# EAGLE design T08-Schematic (EAGLE 7.7.0)
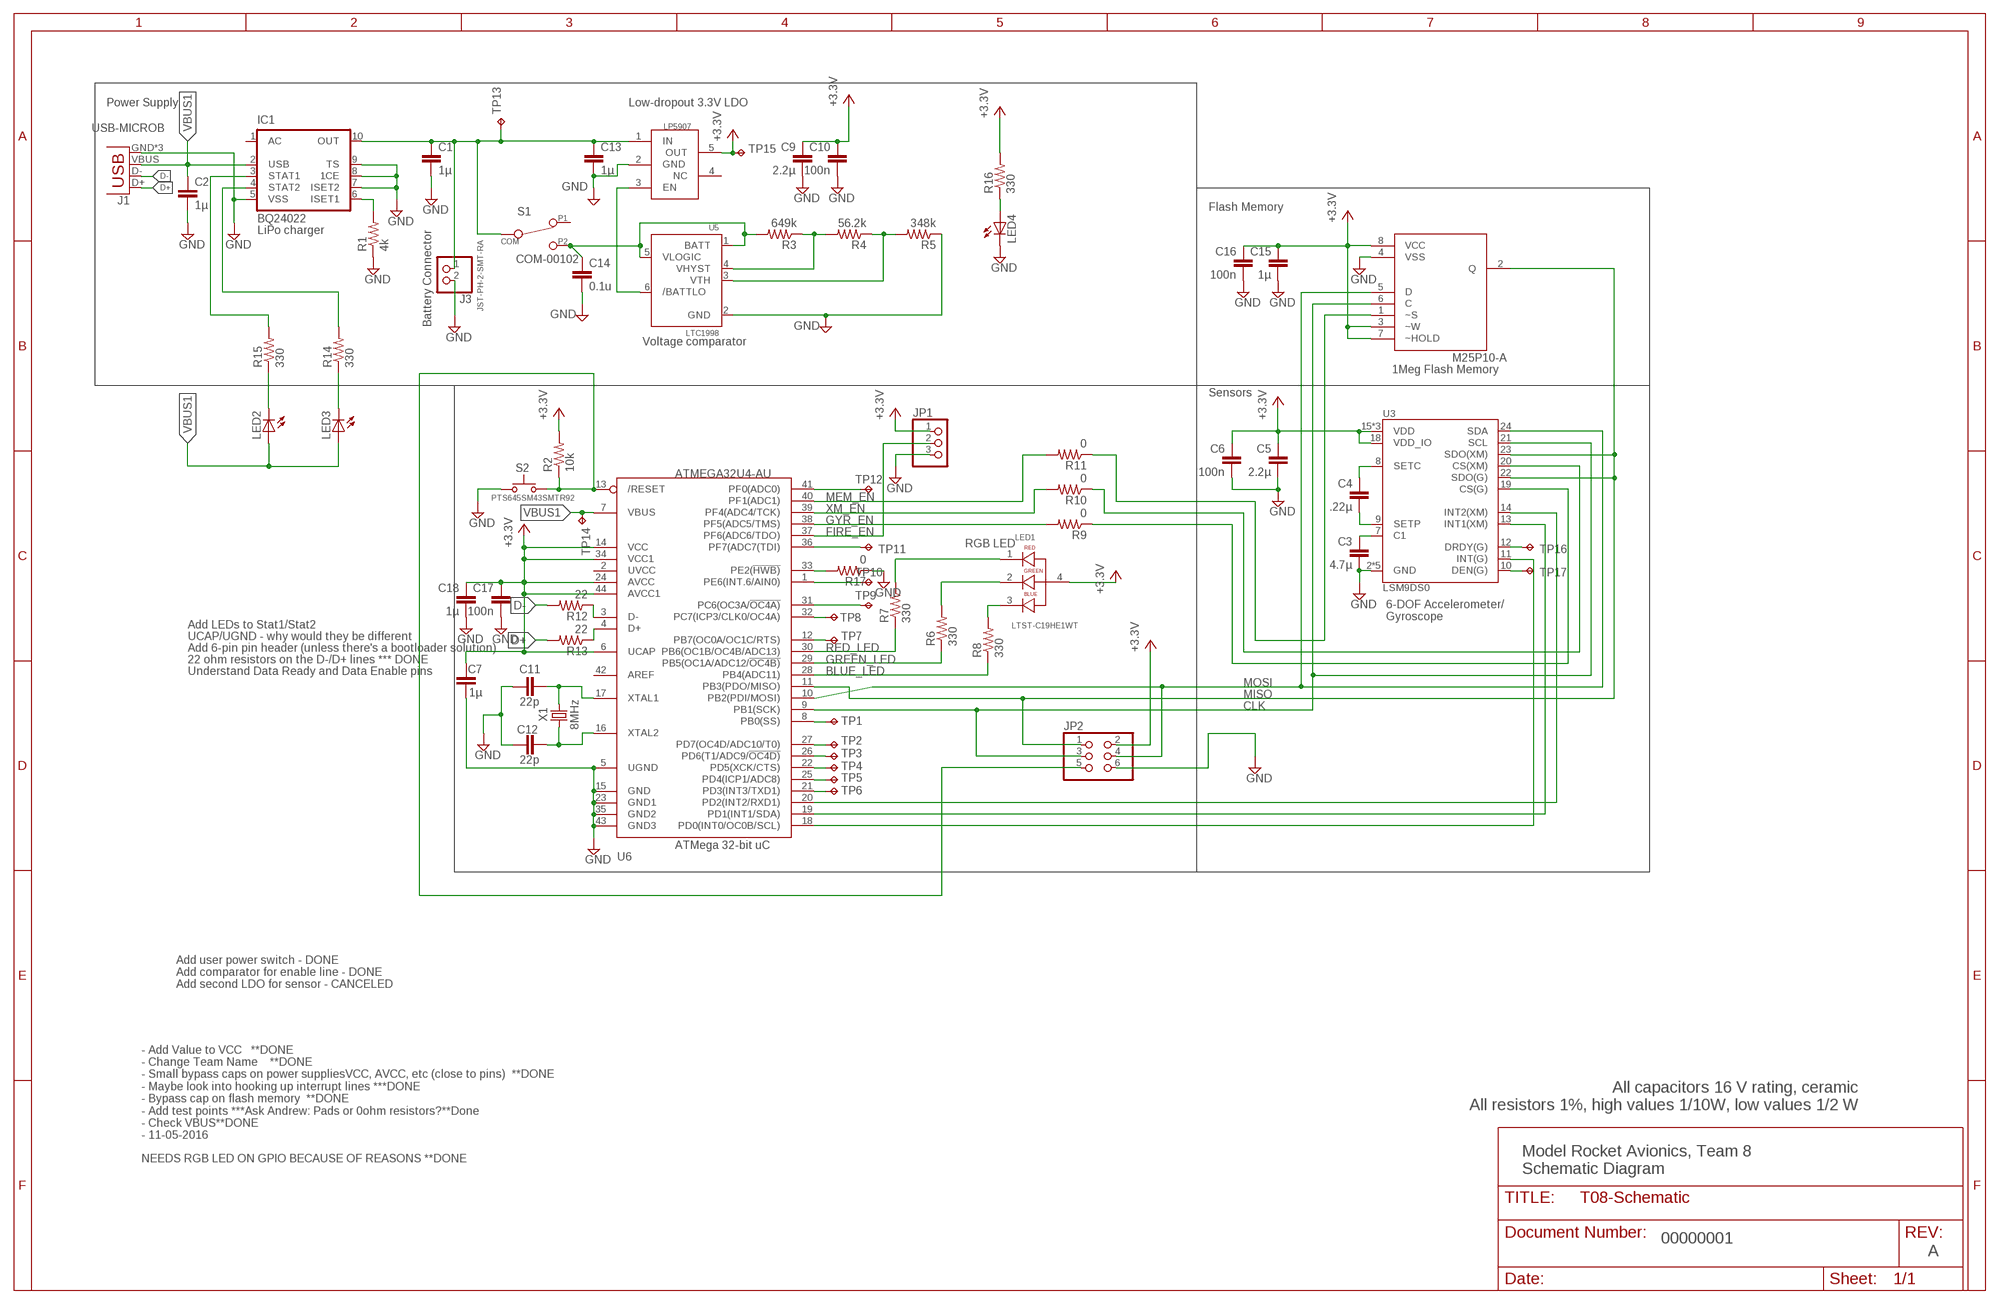
[diagram p0: schematic, sheet 1]

## Parts
C1  1µ  C-EUC0603  [C0603]
C2  1µ  C-EUC0805  [C0805]
C3  4.7µ  C-EUC0603  [C0603]
C4  .22µ  C-EUC0603  [C0603]
C5  2.2µ  C-EUC0603  [C0603]
C6  100n  C-EUC0603  [C0603]
C7  1µ  C-EUC0603  [C0603]
C9  2.2µ  C-EUC0603  [C0603]
C10  100n  C-EUC0603  [C0603]
C11  22p  C-EUC0603  [C0603]
C12  22p  C-EUC0603  [C0603]
C13  1µ  C-EUC0603  [C0603]
C14  0.1u  C-EUC0603  [C0603]
C15  1µ  C-EUC0603  [C0603]
C16  100n  C-EUC0603  [C0603]
C17  100n  C-EUC0603  [C0603]
C18  1µ  C-EUC0603  [C0603]
IC1  BQ24022  [DRC-S-PVSON-N10]
J1  USB-MICROB  [USB-MICROB]
J3  JST-PH-2-SMT-RA  JST_2PIN-SMT-RA  [JST-PH-2-SMT-RA]
JP1  PINHD-1X3  [1X03]
JP2  PINHD-2X3  [2X03]
LED1  LTST-C19HE1WT  [LEDSC85P160X160X35-4N]
LED2  LEDCHIP-LED0603  [CHIP-LED0603]
LED3  LEDCHIP-LED0603  [CHIP-LED0603]
LED4  LEDCHIP-LED0603  [CHIP-LED0603]
R1  4k  R-US_R0603  [R0603]
R2  10k  R-US_R0805  [R0805]
R3  649k  R-US_R0603  [R0603]
R4  56.2k  R-US_R0603  [R0603]
R5  348k  R-US_R0603  [R0603]
R6  330  R-US_R0805  [R0805]
R7  330  R-US_R0805  [R0805]
R8  330  R-US_R0805  [R0805]
R9  0  R-US_R0603  [R0603]
R10  0  R-US_R0603  [R0603]
R11  0  R-US_R0603  [R0603]
R12  22  R-US_R0603  [R0603]
R13  22  R-US_R0603  [R0603]
R14  330  R-US_R0805  [R0805]
R15  330  R-US_R0805  [R0805]
R16  330  R-US_R0805  [R0805]
R17  0  R-US_R0603  [R0603]
S1  COM-00102  [ESWITCH]
S2  PTS645SM43SMTR92  PTS645SSMTR  [PTS645-SMD]
TP1  TPTP08R  [TP08R]
TP2  TPTP08R  [TP08R]
TP3  TPTP08R  [TP08R]
TP4  TPTP08R  [TP08R]
TP5  TPTP08R  [TP08R]
TP6  TPTP08R  [TP08R]
TP7  TPTP08R  [TP08R]
TP8  TPTP08R  [TP08R]
TP9  TPTP08R  [TP08R]
TP10  TPTP08R  [TP08R]
TP11  TPTP08R  [TP08R]
TP12  TPTP08R  [TP08R]
TP13  TPTP08R  [TP08R]
TP14  TPTP08R  [TP08R]
TP15  TPTP08R  [TP08R]
TP16  TPTP08R  [TP08R]
TP17  TPTP08R  [TP08R]
U1  LP5907  [SOT23-5L]
U2  M25P10-AVMN6TP_TR  [SOIC127P600X175-8N]
U3  LSM9DS0  [LGA-24]
U5  LTC1998  [TSOT23-6]
U6  ATMEGA32U4-AU  [TQFP44]
X1  8MHz  CRYSTALS-NOGND-HC49/4H  [HC49]

## Nets
BLUE_LED: R8.1 U6.28(PB4(ADC11))
CLK: JP2.3 U2.6(C) U3.21(SCL) U6.9(PB1(SCK))
D+: J1.D+ R13.2
D-: J1.D- R12.2
FIRE_EN: JP1.2 U6.37(PF6(ADC6/TDO))
GND: C1.2 C2.2 C3.1 C5.2 C6.2 C7.2 C9.2 C10.2 C11.2 C12.2 C13.2 C14.2 C15.2 C16.2 C17.2 C18.2 IC1.5(VSS) IC1.7(ISET2) IC1.8(1CE) IC1.9(TS) J1.GND J1.MT1(GND) J1.MT2(GND) J3.2 JP1.3 JP2.6 LED4.C R1.1 R5.1 R17.1 S2.1(P) S2.2(P) U1.2(GND) U2.4(VSS) U3.2(GND) U3.3(GND) U3.4(GND) U3.5(GND) U3.6(GND) U5.2(GND) U6.5(UGND) U6.15(GND) U6.23(GND1) U6.35(GND2) U6.43(GND3)
GREEN_LED: R6.1 U6.29(PB5(OC1A/ADC12/!OC4B))
GYR_EN: R9.1 U3.19(CS(G))
MEM_EN: R11.1 U2.1(~S)
MISO: JP2.1 U2.2(Q) U3.22(SDO(G)) U3.23(SDO(XM)) U6.11(PB3(PDO/MISO))
MOSI: JP2.4 U2.5(D) U3.24(SDA) U6.10(PB2(PDI/MOSI))
N$1: LED1.1 R7.2
N$2: C11.1 U6.17(XTAL1) X1.1
N$3: JP2.5 R2.1 S2.3(S) S2.4(S) U6.13(/RESET)
N$4: IC1.6(ISET1) R1.2
N$5: C12.1 U6.16(XTAL2) X1.2
N$6: R12.1 U6.3(D-)
N$7: LED1.2 R6.2
N$8: LED1.3 R8.2
N$9: C3.2 U3.7(C1)
N$10: C4.2 U3.8(SETC)
N$11: C4.1 U3.9(SETP)
N$12: R3.1 R4.2 U5.4(VHYST)
N$13: C1.1 C13.1 IC1.10(OUT) J3.1 S1.2(COM) TP13.TP U1.1(IN)
N$14: R4.1 R5.2 U5.3(VTH)
N$15: C14.1 R3.2 S1.3(P2) U5.1(BATT) U5.5(VLOGIC)
N$16: U3.14(INT2(XM)) U6.20(PD2(INT2/RXD1))
N$17: U3.13(INT1(XM)) U6.19(PD1(INT1/SDA))
N$18: U1.3(EN) U5.6(/BATTLO)
N$19: U3.11(INT(G)) U6.18(PD0(INT0/OC0B/SCL))
N$20: R9.2 U6.38(PF5(ADC5/TMS))
N$21: R10.2 U6.39(PF4(ADC4/TCK))
N$22: R11.2 U6.40(PF1(ADC1))
N$47: R13.1 U6.4(D+)
N$48: LED2.C R15.1
N$49: LED3.C R14.1
N$50: IC1.3(STAT1) R15.2
N$51: IC1.4(STAT2) R14.2
N$52: TP3.TP U6.26(PD6(T1/ADC9/!OC4D))
N$53: LED4.A R16.1
N$54: TP12.TP U6.41(PF0(ADC0))
N$55: TP11.TP U6.36(PF7(ADC7(TDI))
N$56: TP10.TP U6.1(PE6(INT.6/AIN0))
N$57: TP9.TP U6.31(PC6(OC3A/!OC4A))
N$58: TP8.TP U6.32(PC7(ICP3/CLK0/OC4A))
N$59: TP7.TP U6.12(PB7(OC0A/OC1C/RTS))
N$60: TP1.TP U6.8(PB0(SS))
N$61: TP2.TP U6.27(PD7(OC4D/ADC10/T0))
N$62: TP4.TP U6.22(PD5(XCK/CTS))
N$63: TP5.TP U6.25(PD4(ICP1/ADC8))
N$64: TP6.TP U6.21(PD3(INT3/TXD1))
N$65: R17.2 U6.33(PE2(!HWB))
N$66: TP17.TP U3.10(DEN(G))
N$67: TP16.TP U3.12(DRDY(G))
RED_LED: R7.1 U6.30(PB6(OC1B/OC4B/ADC13))
VBUS1: C2.1 IC1.2(USB) J1.VBUS LED2.A LED3.A TP14.TP U6.7(VBUS)
VCC: C5.1 C6.1 C7.1 C9.1 C10.1 C15.1 C16.1 C17.1 C18.1 JP1.1 JP2.2 LED1.4 R2.2 R16.2 TP15.TP U1.5(OUT) U2.3(~W) U2.7(~HOLD) U2.8(VCC) U3.15(VDD) U3.16(VDD) U3.17(VDD) U3.18(VDD_IO) U6.6(UCAP) U6.14(VCC) U6.24(AVCC) U6.34(VCC1) U6.44(AVCC1) ; supply symbol labelled +3.3V
XM_EN: R10.1 U3.20(CS(XM))
Unconnected: IC1.1(AC) IC1.TH S1.1 U1.4(NC) U6.2(UVCC) U6.42(AREF)

## Notes on the sheet
- Power Supply | Low-dropout 3.3V LDO
- Flash Memory
- LiPo charger
- Battery Connector
- Voltage comparator
- 1Meg Flash Memory
- Sensors
- RGB LED
- 6-DOF Accelerometer/
  Gyroscope
- Add LEDs to Stat1/Stat2
- UCAP/UGND - why would they be different
- Add 6-pin pin header (unless there's a bootloader solution)
- 22 ohm resistors on the D-/D+ lines *** DONE
- Understand Data Ready and Data Enable pins
- ATMega 32-bit uC
- Add user power switch - DONE
  Add comparator for enable line - DONE
  Add second LDO for sensor - CANCELED
- All capacitors 16 V rating, ceramic
  All resistors 1%, high values 1/10W, low values 1/2 W
- - Add Value to VCC   **DONE
  - Change Team Name    **DONE
  - Small bypass caps on power suppliesVCC, AVCC, etc (close to pins)  **DONE
  - Maybe look into hooking up interrupt lines ***DONE
  - Bypass cap on flash memory  **DONE
  - Add test points ***Ask Andrew: Pads or 0ohm resistors?**Done
  - Check VBUS**DONE
  - 11-05-2016
- NEEDS RGB LED ON GPIO BECAUSE OF REASONS **DONE
- Model Rocket Avionics, Team 8
  Schematic Diagram
- 00000001
- A

## Library data of the parts
C1-C7 C9-C18 = rcl:C-EU: CAPACITOR, European symbol
IC1 = texas:BQ24022: SINGLE-CHIP, LI-ION AND LI-POL CHARGER IC WITH AUTONOMOUS USB-PORT AND AC-ADAPTER SUPPLY MANAGEMENT (bqTINY™-II) Source: bq24022.pdf (www.ti.com)
J1 = SparkFun-Connectors:USB: USB Connectors USB-B-PTH is fully proven SKU : PRT-00139/CONN-08278 USB-miniB is fully proven SKU : PRT-00587 USB-A-PCB is untested. USB-A-H is throughly reviewed, but untested. Spark Fun Electronics SKU : PRT-00437 USB-B-SMT is throughly reviewed, but untested. Needs silkscreen touching up. USB-A-S has not been used/tested USB-MB-H has not been used/tested USB-MICROB has been used. CONN-09505; PROD_ID: CONN-09505
J3 = adafruit:JST_2PIN: JST 2-Pin Connectors of various flavors SMT-RA (S2B-PH-SM4) 4UConnector #17311 SMT (B2B-PH-SM4) THM-RA (S2B-PH) THM (B2B-PH)
JP1 = pinhead:PINHD-1X3: PIN HEADER
JP2 = pinhead:PINHD-2X3: PIN HEADER
LED1 = LTST-C19HE1WT:LTST-C19HE1WT: R/G/B 0606 Flat Top Rectangle 130° 112.5/281/104 mcd Diffused Chip LED; AVAILABILITY: Good; DESCRIPTION: R/G/B 0606 Flat Top Rectangle 130° 112.5/281/104 mcd Diffused Chip LED; MF: Lite-On; MP: LTST-C19HE1WT; PACKAGE: None; PRICE: 0.59 USD; VENDOR: DIGIKEY; VENDOR_PN: 160-2162-1-ND
LED2-LED4 = adafruit:LED: LED OSRAM: - CHIPLED LG R971, LG N971, LY N971, LG Q971, LY Q971, LO R971, LY R971 LH N974, LH R974 LS Q976, LO Q976, LY Q976 LO Q996 - Hyper CHIPLED LW Q18S LB Q993, LB Q99A, LB R99A - SideLED LS A670, LO A670, LY A670, LG A670, LP A670 LB A673, LV A673, LT A673, LW A673 LH A674 LY A675 LS A676, LA A676, LO A676, LY A676, LW A676 LS A679, LY A679, LG A679 - Hyper Micro SIDELED® LS Y876, LA Y876, LO Y876, LY Y876 LT Y87S - SmartLED LW L88C, LW L88S LB L89C, LB L89S, LG L890 LS L89K, LO L89K, LY L89K LS L896, LA L896, LO L896, LY L896 - TOPLED LS T670, LO T670, LY T670, LG T670, LP T670 LSG T670, LSP T670, LSY T670, LOP T670, LYG T670 LG T671, LOG T671, LSG T671 LB T673, LV T673, LT T673, LW T673 LH T674 LS T676, LA T676, LO T676, LY T676, LB T676, LH T676, LSB T676, LW T676 LB T67C, LV T67C, LT T67C, LS T67K, LO T67K, LY T67K, LW E67C LS E67B, LA E67B, LO E67B, LY E67B, LB E67C, LV E67C, LT E67C LW T67C LS T679, LY T679, LG T679 LS T770, LO T770, LY T770, LG T770, LP T770 LB T773, LV T773, LT T773, LW T773 LH T774 LS E675, LA E675, LY E675, LS T675 LS T776, LA T776, LO T776, LY T776, LB T776 LHGB T686 LT T68C, LB T68C - Hyper Mini TOPLED® LB M676 - Mini TOPLED Santana® LG M470 LS M47K, LO M47K, LY M47K Source: http://www.osram.convergy.de/
R1-R17 = rcl:R-US_: RESISTOR, American symbol
S1 = tinyav-lib:COM-00102: Small SPDT switch listed on SparkFun as COM-00102. Equivalent to E-Switch EG1218.
S2 = switch-ck:PTS645S???SMTR: TACT SWITCH; MPN: PTS645SM43SMTR92 LFS; VENDOR: DIGIKEY; VENDOR_PN: CKN9112CT-ND
TP1-TP17 = testpad:TP: Test pad
U1 = adafruit:LP5907
U2 = SOIC127P600X175-8N:M25P10-AVMN6TP_TR
U3 = LSM9DS0:LSM9DS0; AVAILABILITY: Warning; DESCRIPTION: iNEMO inertial module: 3D accelerometer, 3D gyroscope, 3D magnetometer; MF: STMicroelectronics; MP: LSM9DS0; PACKAGE: LGA-24 STMicroelectronics; PRICE: 4.67 USD
U5 = tinyav-lib:LTC1998
U6 = adafruit:ATMEGA32U4: http://www.ladyada.net/library/eagle
X1 = IQD-Frequency-Products:CRYSTALS-NOGND: CRYSTALS CAN NOT GROUNDED; MPN: ATS080B; VENDOR: DIGIKEY; VENDOR_PN: CTX900-ND

## Board
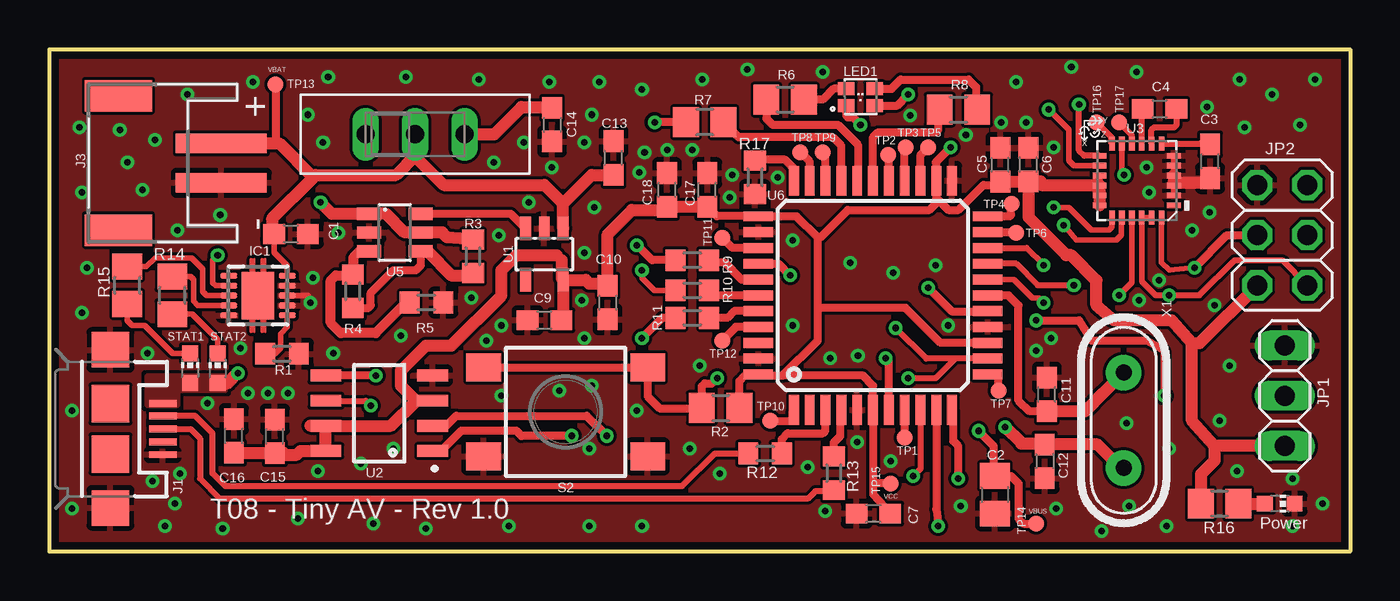
[diagram p1: board, top side]
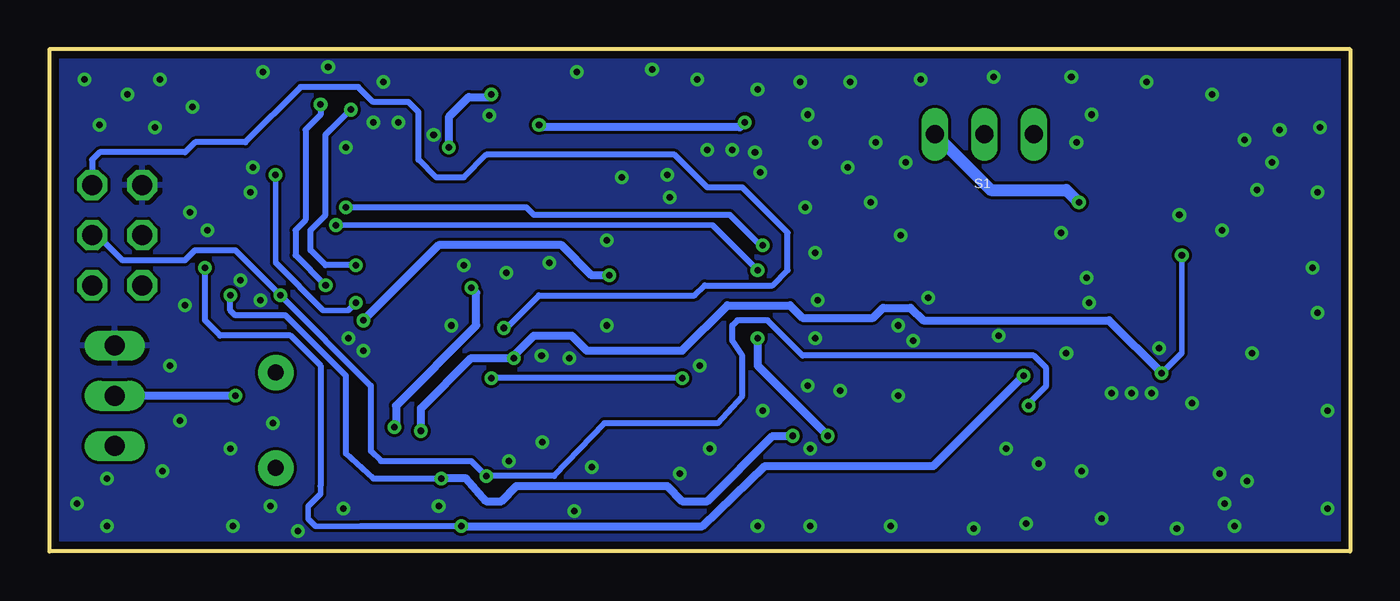
[diagram p2: board, bottom side, seen from below]

Size 65.79 x 25.4 mm. Coordinates in mm from the lower left corner, seen from the top.
Outline: 0,25.4 0,0 65.79,0 65.79,25.4 0,25.4
Copper layers (1*16): Top 0.0356mm / dielectric 1.5011mm / Bottom 0.0356mm
Design rules "LaenPCBOrder": minimum track width 6mil, minimum drill 13mil, track to track 6mil, track to pad 6mil, pad to pad 6mil, via to via 6mil, smd to smd 6mil, copper to edge 15mil, drill to drill 6mil, minimum pad ring 7mil, minimum via ring 7mil, stop-mask expansion 3mil, vias tented up to drill 0mil, thermal gap 10mil

### Footprints (pad centres in the part's own frame; a part is rotated, then mirrored left to right if it is on the bottom)
C0603 = smd 1.1 x 1: 1 -0.85,0; 2 0.85,0
C0805 = smd 1.3 x 1.5: 1 -0.95,0; 2 0.95,0
DRC-S-PVSON-N10 = smd 0.28 x 0.85: 1 -1,-1.475; 2 -0.5,-1.475; 3 0,-1.475; 4 0.5,-1.475; 5 1,-1.475; 6 1,1.475; 7 0.5,1.475; 8 0,1.475; 9 -0.5,1.475; 10 -1,1.475 | smd 2.4 x 1.65: TH 0,0
USB-MICROB = smd 0.35 x 1.4: D+ 0,2.65; D- -0.65,2.65; GND 1.3,2.65; ID 0.65,2.65; VBUS -1.3,2.65 | smd 1.8 x 1.9: MT1 -4,0; MT2 4,0 | smd 1.9 x 1.9: P$1 -1.27,0; P$2 1.27,0
JST-PH-2-SMT-RA = smd 1 x 4.6: 1 1,-3.7; 2 -1,-3.7 | smd 1.6 x 3.4: NC1 -3.4,1.5; NC2 3.4,1.5
1X03 = drill 1.016 long: 1 -2.54,0; 2 0,0; 3 2.54,0
2X03 = drill 1.016 octagon: 1 -2.54,-1.27; 2 -2.54,1.27; 3 0,-1.27; 4 0,1.27; 5 2.54,-1.27; 6 2.54,1.27
LEDSC85P160X160X35-4N = smd 0.65 x 0.85: 1 -0.425,0.725; 2 0.425,0.725; 3 0.425,-0.725; 4 -0.425,-0.725
CHIP-LED0603 = smd 0.8 x 0.8: A 0,-0.75; C 0,0.75
R0603 = smd 1 x 1.1: 1 -0.85,0; 2 0.85,0
R0805 = smd 1.3 x 1.5: 1 -0.95,0; 2 0.95,0
ESWITCH = drill 0.9 pad 1.2 long: 1 -2.5,0; 2 0,0; 3 2.5,0
PTS645-SMD = smd 1.75 x 1.4: 1 -4.15,2.25; 2 4.15,2.25; 3 -4.15,-2.25; 4 4.15,-2.25
TP08R = smd 0.8 x 0.8: TP 0,0
SOT23-5L = smd 0.55 x 1.2: 1 -0.95,-1.3; 2 0,-1.3; 3 0.95,-1.3; 4 0.95,1.3; 5 -0.95,1.3
SOIC127P600X175-8N = smd 1.55 x 0.6: 1 -2.7,1.905; 2 -2.7,0.635; 3 -2.7,-0.635; 4 -2.7,-1.905; 5 2.7,-1.905; 6 2.7,-0.635; 7 2.7,0.635; 8 2.7,1.905
LGA-24 = smd 0.7 x 0.29: 1 -1.875,1.25; 2 -1.875,0.75; 3 -1.875,0.25; 4 -1.875,-0.25; 5 -1.875,-0.75; 6 -1.875,-1.25; 13 1.875,-1.25; 14 1.875,-0.75; 15 1.875,-0.25; 16 1.875,0.25; 17 1.875,0.75; 18 1.875,1.25 | smd 0.29 x 0.7: 7 -1.25,-1.875; 8 -0.75,-1.875; 9 -0.25,-1.875; 10 0.25,-1.875; 11 0.75,-1.875; 12 1.25,-1.875; 19 1.25,1.875; 20 0.75,1.875; 21 0.25,1.875; 22 -0.25,1.875; 23 -0.75,1.875; 24 -1.25,1.875
TSOT23-6 = smd 0.62 x 1.22: 1 -0.95,-1.3; 2 0,-1.3; 3 0.95,-1.3; 4 0.95,1.3; 5 0,1.3; 6 -0.95,1.3
TQFP44 = smd 1.5 x 0.5: 1 -5.8,4; 2 -5.8,3.2; 3 -5.8,2.4; 4 -5.8,1.6; 5 -5.8,0.8; 6 -5.8,0; 7 -5.8,-0.8; 8 -5.8,-1.6; 9 -5.8,-2.4; 10 -5.8,-3.2; 11 -5.8,-4; 23 5.8,-4; 24 5.8,-3.2; 25 5.8,-2.4; 26 5.8,-1.6; 27 5.8,-0.8; 28 5.8,0; 29 5.8,0.8; 30 5.8,1.6; 31 5.8,2.4; 32 5.8,3.2; 33 5.8,4 | smd 0.5 x 1.5: 12 -4,-5.8; 13 -3.2,-5.8; 14 -2.4,-5.8; 15 -1.6,-5.8; 16 -0.8,-5.8; 17 0,-5.8; 18 0.8,-5.8; 19 1.6,-5.8; 20 2.4,-5.8; 21 3.2,-5.8; 22 4,-5.8; 34 4,5.8; 35 3.2,5.8; 36 2.4,5.8; 37 1.6,5.8; 38 0.8,5.8; 39 0,5.8; 40 -0.8,5.8; 41 -1.6,5.8; 42 -2.4,5.8; 43 -3.2,5.8; 44 -4,5.8
HC49 = drill 0.813 pad 1.8: 1 -2.413,0; 2 2.413,0

### Placement (x,y rotation side)
C1  12.22,16.06 0 top
C2  47.82,2.87 270 top
C3  58.71,19.74 90 top
C4  56.15,22.39 0 top
C5  48.09,19.56 90 top
C6  49.52,19.57 90 top
C7  41.68,1.92 180 top
C9  25.04,11.7 180 top
C10  28.23,12.59 270 top
C11  50.45,7.94 90 top
C12  50.34,4.56 270 top
C13  28.53,19.9 90 top
C14  25.42,21.59 270 top
C15  11.4,5.82 90 top
C16  9.33,5.84 90 top
C17  33.27,18.29 90 top
C18  31.24,18.29 90 top
IC1  10.55,12.94 270 top
J1  3.09,6.2 270 top
J3  4.99,19.65 90 top
JP1  62.48,7.87 90 top
JP2  62.36,16 90 top
LED1  41.02,22.99 90 top
LED2  7.11,9.27 0 top
LED3  8.51,9.27 0 top
LED4  62.23,2.41 270 top
R1  11.77,10 180 top
R2  33.95,7.26 0 top
R3  21.42,14.93 90 top
R4  15.35,13.16 270 top
R5  19.07,12.59 180 top
R6  37.21,22.86 0 top
R7  33.15,21.72 180 top
R8  45.97,22.35 0 top
R9  32.51,14.73 0 top
R10  32.51,13.21 0 top
R11  32.51,11.81 0 top
R12  36.2,4.95 180 top
R13  39.68,3.95 270 top
R14  6.22,12.95 90 top
R15  3.94,13.46 90 top
R16  59.18,2.41 180 top
R17  35.69,18.92 90 top
S1  18.49,21.11 0 top
S2  26.11,7.06 180 top
TP1  43.26,5.75 0 top
TP2  42.42,20.07 0 top
TP3  43.31,20.45 0 top
TP4  48.66,17.59 0 top
TP5  44.45,20.45 0 top
TP6  48.9,16.13 0 top
TP7  48.01,8.13 0 top
TP8  37.97,20.19 0 top
TP9  39.12,20.19 0 top
TP10  36.45,6.6 0 top
TP11  34.04,15.88 0 top
TP12  34.04,10.67 0 top
TP13  11.43,23.62 0 top
TP14  49.91,1.4 0 top
TP15  42.55,3.43 0 top
TP16  52.96,21.72 0 top
TP17  54.1,21.72 0 top
U1  25.03,15.04 180 top
U2  16.68,6.99 180 top
U3  55,18.76 180 top
U5  17.47,16.14 270 top
U6  41.66,12.95 90 top
X1  54.34,6.63 270 top

### Tracks (layer width: path | path; a pad name or v marks a point on that pad's centre or on a via)
BLUE_LED
  Top 0.406: 44.78,22.34 R8.1 | 45.09,22.29 R8.1 | U6.28 41.66,20.95 41.91,21.21 44.83,21.21 44.96,21.34 44.96,22.29 R8.1
CLK  (via drill 0.33)
  Top 0.279: U3.21 54.75,13.6 v54.1,12.95
  Top 0.305: U6.9 44.06,4.18 v43.69,3.81 | U2.6 16,7.62 v16.26,7.37
  Bottom 0.305: v16.26,7.37 16.26,7.49 15.37,8.38 15.37,9.27 16,9.91 27.69,9.91 29.46,11.68 30.99,11.68 31.24,11.43 31.24,10.67 30.73,9.91 30.73,7.87 32,6.48 37.72,6.48 40.26,3.81 v43.69,3.81 44.45,4.57 49.02,4.57 49.53,5.08 49.53,8.38 v54.1,12.95 56.39,15.24 58.42,15.24 58.93,14.73 62.1,14.73 63.37,16 JP2.3
D+
  Top 0.305: J1.D+ 7.14,6.2 7.62,5.71 7.62,3.68 8.64,2.67 38.35,2.67 38.73,3.05 39.62,3.05
  Top 0.406: 39.62,3.05 R13.2
D-
  Top 0.305: J1.D- 7.37,6.86 8.26,5.97 8.26,3.94 8.89,3.3 32,3.3 33.66,4.95 R12.2
FIRE_EN  (via drill 0.33)
  Top 0.406: U6.37 36.88,14.55 v37.47,13.97 | v49.91,11.68 52.07,11.68 52.7,10.67 55.5,10.67 56.39,10.16 v56.39,7.87
  Bottom 0.406: v37.47,13.97 38.35,13.97 39.88,15.49 46.1,15.49 v49.91,11.68 | v56.39,7.87 JP1.2
GND  (via drill 0.33)
  Top 0.279: IC1.8 13.09,12.94 v13.21,12.57
  Top 0.305: U3.6 U3.5 U3.4 U3.3 U3.2
  Top 0.61: U3.4 56.87,18.69 56.9,18.67 58.59,18.67 C3.1
  other vias: 13.08,22.1 3.94,19.68 24,20.7 27.05,20.7 29.84,19.18 37.59,15.75 42.55,4.57 49.4,21.72 48.13,21.72 8.64,17.02 10.03,8 22.86,11.43 40.85,5.52 25.78,8.13 29.72,7.11 32.89,9.4 17.78,10.92 11.05,8 12.06,8 27.3,5.21 27.56,17.4 6.99,23.11 18.03,24 25.27,23.75 14.1,24 1.52,21.46 27.3,1.27 19.05,1.14 31.24,20.32 34.54,19.05 48.9,23.75 54.99,24.26 40.51,14.61 27.05,15.11 14.61,16.13 50.8,20.45 32.51,20.32 30.1,20.19 39.24,2.03 46.1,2.29 26.92,12.7 27.05,10.79 22.1,10.67 27.43,22.1 25.4,19.43 24.26,17.65 50.93,2.16 53.21,1.02 49.91,10.16 50.67,10.79 55.63,18.16 55.5,19.43 29.97,1.27 54.48,6.48 54.61,2.29 23.24,1.27 1.65,18.16 37.59,11.43 21.72,23.88 17.4,5.21 15.75,4.45 22.73,16 4.7,18.29 27.81,23.75 22.86,7.87 32.38,5.21 14.35,10.03 13.84,20.7 22.48,19.68 38.34,4.26 43.53,22.05 33.91,3.94 40.89,9.91 9.65,10.29 13.34,13.84 21.34,12.83 8,7.49 1.65,12.06 1.91,14.35 1.14,7.11 6.35,2.41 1.14,2.16 8.76,1.14 12.57,1.65 16.38,1.4 13.59,4.06 5.21,3.56 6.6,3.94 4.95,10.03 5.84,1.27 6.48,16.26 58.93,12.45 56.13,13.72 55.12,12.7 44.83,14.48 42.67,14.1 59.69,9.4 59.18,6.6 57.78,16.26 58.67,17.14 36.83,18.92 3.56,21.34 33.02,23.88 39.12,24.26 35.31,24.38 29.97,23.37 10.29,23.75 60.07,4.06 64.39,2.41 62.87,3.68 62.87,1.27 56.64,5.21 56.52,1.27 58.55,22.48 60.2,23.88 60.45,21.46 61.85,23.11 64.01,23.88 63.25,21.59 46.35,21.08 34.42,17.91 45.47,11.43 39.5,9.78 51.69,24.51 27.43,8.38 5.33,20.83
  pour Bottom (rank 2): 0,25.4 65.79,25.4 65.79,0 0,0
  pour Top (rank 2): 0,25.4 65.79,25.4 65.79,0 0,0
GREEN_LED
  Top 0.406: R6.1 36.26,21.91 36.58,21.59 39.88,21.59 40.89,20.57 40.89,18.79 U6.29
GYR_EN  (via drill 0.33)
  Top 0.279: U3.19 53.75,16.41 53.59,16.26 52.7,16.26 51.56,17.4 v50.8,17.4
  Top 0.406: R9.1 30.48,14.73 v29.72,15.49
  Bottom 0.305: v29.72,15.49 29.84,15.49 31.37,17.02 41.27,17.02 41.66,17.4 v50.8,17.4
MEM_EN  (via drill 0.33)
  Top 0.406: v26.42,5.84 23.88,5.84 23.62,6.1 20.83,6.1 19.81,5.08 U2.1 | R11.1 30.99,11.81 v29.97,10.79
  Bottom 0.406: v29.97,10.79 29.97,9.4 v26.42,5.84
MISO  (via drill 0.33)
  Top 0.279: U3.22 55.25,13.65 55.94,12.96
  Top 0.305: U3.22 U3.23 | 55.94,12.96 56.63,12.96 | 56.63,12.96 v56.64,12.95 | 56.63,12.96 58.17,12.96 59.94,14.73 62.36,14.73 JP2.1
  Top 0.406: U2.2 20.07,6.35 20.57,6.86 27.18,6.86 v28.19,5.84 | v45.97,3.68 45.97,5.33 45.72,5.59 45.72,7.09 U6.11
  Bottom 0.305: v45.97,3.68 49.4,3.68 50.8,4.95 50.8,8.89 53.85,11.94 56.39,11.94 56.64,12.19 v56.64,12.95
  Bottom 0.406: v45.97,3.68 44.7,3.68 43.69,2.54 42.93,2.54 42.16,3.3 34.54,3.3 33.78,2.54 32.51,2.54 29.21,5.84 v28.19,5.84
MOSI  (via drill 0.33)
  Top 0.279: U3.24 56.25,14.62 56.64,14.22 v57.91,14.35
  Top 0.305: 57.91,14.22 v57.91,14.35
  Top 0.406: U6.10 44.86,2.13 v44.96,1.27 | v16.51,8.89 U2.5 | 57.91,14.22 v57.91,14.35 59.56,16 JP2.4
  Bottom 0.279: 52.07,3.3 52.07,2.92 52.7,2.29 52.7,1.65 52.32,1.27 50.04,1.27
  Bottom 0.305: 52.07,3.3 52.07,9.4 53.59,10.92 57.15,10.92 57.91,11.68 v57.91,14.35 | v44.96,1.27 50.04,1.27
  Bottom 0.406: v44.96,1.27 32.77,1.27 29.59,4.32 21.08,4.32 v16.51,8.89
N$1  (via drill 0.33)
  Top 0.406: R7.2 v30.61,21.72 | LED1.1 40.3,22.06 40.39,21.97 40.64,21.97 v41.02,21.59
  Bottom 0.406: v30.61,21.72 30.86,21.46 40.89,21.46 v41.02,21.59
N$2
  Top 0.406: U6.17 48.51,12.95 49.02,12.45 49.02,7.62 49.53,7.11 50.43,7.11 C11.1
  Top 0.61: X1.1 53.3,8.01 53.29,8.01 52.37,7.09 C11.1
N$3  (via drill 0.33)
  Top 0.305: 33.89,8.66 v33.78,8.76 | v43.43,8.76 44.83,8.76 45.85,9.78 47.43,9.78 U6.13 44.35,9.75 v42.8,11.3
  Top 0.406: S2.4 S2.3 30.26,7.84 30.86,7.24 32.98,7.24 R2.1 33,8.36 33.15,8.51 33.53,8.51 v33.78,8.76
  Bottom 0.305: v33.78,8.76 v43.43,8.76 | v42.8,11.3 42.67,11.3 41.02,12.95 33.15,12.95 32.64,13.46 29.21,13.46 28.45,14.22 28.45,16.13 30.73,18.41 32.51,18.41 34.16,20.07 43.69,20.07 44.83,18.92 46.23,18.92 47.12,19.81 47.12,22.23 47.62,22.73 49.4,22.73 50.16,23.5 53.09,23.5 55.88,20.7 58.42,20.7 58.93,20.19 63.25,20.19 63.63,19.81 JP2.5
N$4
  Top 0.279: R1.2 11.4,10 11.68,10.29 11.68,11.01 12.03,11.35 IC1.6
N$5  (via drill 0.33)
  Top 0.406: U6.16 45.64,12.15 v44.45,13.34
  Top 0.61: X1.2 54.19,4.22 53.01,5.41 C12.1 50.28,5.46 49.15,5.46 49.15,5.48 v48.34,6.29
  Bottom 0.406: v44.45,13.34 44.2,13.08 44.2,11.43 48.26,7.37 48.26,6.37 v48.34,6.29
N$6
  Top 0.406: R12.1 37.05,5.68 37.34,5.97 39.12,5.97 39.24,6.1 39.24,7.14 U6.3
N$7
  Top 0.406: LED1.2 39.67,23.41 39.12,22.86 R6.2
N$8
  Top 0.406: LED1.3 42.59,23.41 43.05,23.88 46.48,23.88 46.86,23.5 46.86,22.41 R8.2
N$9
  Top 0.305: U3.7 58.19,20.64 C3.2
N$10
  Top 0.305: U3.8 55.75,21.33 55.88,21.46 56.9,21.46 57.02,21.59 57.02,22.36 C4.2
N$11
  Top 0.305: U3.9 55.25,22.33 C4.1
N$12
  Top 0.406: U5.4 18.79,15.16 18.8,15.16 18.8,14.48 18.54,14.22 17.4,14.22 16.26,13.08 16.26,12.45 16.12,12.31 R4.2
  Top 0.61: 18.79,15.16 19.13,15.16 20.32,13.97 21.41,13.97 R3.1
N$13
  Top 0.279: IC1.10 12.03,14.47 11.37,15.13 C1.1
  Top 0.406: 11.01,15.8 C1.1 | TP13.TP 11.43,20.83 11.61,20.65
  Top 0.61: C1.1 11.27,16.86 13.34,18.92 | 13.34,18.92 13.46,19.05 17.53,19.05 18.49,20.02 S1.2 18.49,19.99 19.94,18.54 25.04,18.54 25.98,17.6 | J3.1 11.61,20.65 13.34,18.92 | U1.1 25.98,17.6 | 25.98,17.6 27.43,19.05 C13.1
N$14
  Top 0.508: U5.3 15.69,15.19 15.37,14.86 15.37,14.03 R4.1 15.31,13.97 14.48,13.97 14.22,13.72 14.22,11.56 14.73,11.05 16.51,11.05 18.05,12.59 R5.2
N$15  (via drill 0.33)
  Top 0.61: R3.2 20.12,15.88 19.87,16.13 U5.5 | U5.5 | v13.72,17.65 14.28,17.08 U5.1 17.02,17.09 17.98,16.13 U5.5 | C14.1 25.38,22.48 23.88,22.48 22.5,21.11 S1.3
  Bottom 0.61: v13.72,17.65 14.35,18.29 18.18,18.29 S1.3
N$16  (via drill 0.33)
  Top 0.279: 51.56,21.34 51.56,19.77 51.81,19.52 U3.14
  Top 0.305: U6.20 49.42,15.35 v50.29,14.48 | v50.55,22.35 51.56,21.34
  Bottom 0.305: v50.29,14.48 51.82,14.48 52.58,15.24 52.58,16.26 51.82,17.02 51.82,21.08 v50.55,22.35
N$17  (via drill 0.33)
  Top 0.305: U3.13 52.34,20.01 52.08,20.28 v52.08,22.6 v52.07,22.61 | v51.82,13.46 49.99,13.46 48.9,14.55 U6.19
  Bottom 0.305: v52.07,22.61 52.07,22.1 52.83,21.34 52.83,16.76 53.34,16.26 53.34,14.99 v51.82,13.46
N$18
  Top 0.406: U5.6 23.33,17.09 U1.3
N$19  (via drill 0.33)
  Top 0.279: U3.11 54.25,19.16 v54.36,19.05 | U6.18 47.47,13.76 48.78,13.76 49.72,12.83 50.04,12.83 v50.29,12.57
  Bottom 0.279: v54.36,19.05 54.36,14.61 51.94,12.19 50.67,12.19 v50.29,12.57
N$20
  Top 0.406: U6.38 35.01,13.75 34.16,14.61 33.49,14.61 R9.2
N$21
  Top 0.406: U6.39 33.46,12.95 R10.2
N$22
  Top 0.406: U6.40 34.63,12.15 34.29,11.81 R11.2
N$47
  Top 0.406: U6.4 40.01,7.1 40.01,5.84 39.68,5.51 R13.1
N$48
  Top 0.279: LED2.C 6.24,10.02 4.83,11.43 4.19,11.43 3.94,11.68 R15.1
N$49
  Top 0.279: LED3.C 8.51,10.71 7.22,12 R14.1
N$50
  Top 0.279: R15.2 4.9,14.41 5.34,14.85 7.19,14.85 7.74,14.3 7.74,13.15 7.95,12.94 IC1.3
N$51
  Top 0.279: R14.2 6.23,13.89 7.14,13.89 7.29,13.75 7.29,12.67 7.51,12.44 IC1.4
N$52
  Top 0.406: U6.26 43.26,20.4 TP3.TP
N$53
  Top 0.61: R16.1 LED4.A
N$54
  Top 0.406: U6.41 34.72,11.35 TP12.TP
N$55
  Top 0.406: U6.36 34.56,15.35 TP11.TP
N$56
  Top 0.406: TP10.TP 37.59,6.6 37.59,7.09 U6.1
N$57
  Top 0.406: U6.31 39.26,20.05 TP9.TP
N$58
  Top 0.406: U6.32 38.46,19.71 TP8.TP
N$59
  Top 0.406: TP7.TP 48.01,8.89 47.52,8.89 U6.12
N$60
  Top 0.406: U6.8 TP1.TP
N$61
  Top 0.406: U6.27 42.46,20.03 TP2.TP
N$62
  Top 0.406: U6.22 48.58,16.95 48.64,17.02 48.64,17.57 TP4.TP
N$63
  Top 0.406: U6.25 44.06,20.05 TP5.TP
N$64
  Top 0.406: U6.21 48.77,16.15 TP6.TP
N$65
  Top 0.406: U6.33 37.66,19.37 37.21,19.81 35.73,19.81 R17.2
N$66
  Top 0.305: U3.10 54.75,21.07 TP17.TP
N$67
  Top 0.305: U3.12 53.72,20.64 53.72,20.95 TP16.TP
RED_LED
  Top 0.406: 34.16,21.65 R7.1 34.86,20.95 39.62,20.95 40.06,20.52 U6.30
VBUS1  (via drill 0.33)
  Top 0.279: IC1.2 8.4,13.44 8.26,13.59 8.26,14.73 v8.51,14.99 | 8.52,8.51 LED3.A
  Top 0.406: U6.7 42.46,9.61 v42.29,9.78 | v46.99,6.1 47.75,5.33 47.75,3.88 C2.1 48.63,3.82 49.02,3.43 49.02,1.65 49.28,1.4 TP14.TP
  Top 0.61: 8.52,8.51 9.02,8.51 v9.53,9.02
  Bottom 0.279: v8.51,14.99 8.51,10.03 v9.53,9.02
  Bottom 0.406: v9.53,9.02 12.19,11.68 21.59,11.68 22.23,12.32 23.62,12.32 24.13,11.81 27.69,11.81 28.32,12.45 31.5,12.45 33.78,10.16 38.61,10.16 39.37,10.92 41.27,10.92 42.29,9.91 v42.29,9.78 44.45,9.78 46.99,7.24 v46.99,6.1
  pour Top (no thermals): 5.08,7.37 4.95,7.37 4.95,8.89 8.89,8.89 8.89,8.13 6.48,8.13 6.48,7.37
VCC  (via drill 0.33)
  Top 0.305: U3.16 U3.15
  Top 0.406: 37.08,8.89 41.15,8.89 41.66,8.38 U6.6 41.66,3.56 | U6.44 35.92,8.89 37.08,8.89 | 37.08,8.89 38.86,10.67 38.86,12.45 | 38.86,12.45 38.86,15.88 | 38.86,15.88 37.79,16.95 U6.34 33.76,16.95 C17.1 | 35.79,8.89 U6.44 | U2.3 18.54,7.62 | 25.65,14.99 25.91,14.73 | 25.91,13.81 U1.5 | 38.86,15.88 39,15.88 40.39,17.27 44.5,17.27 44.85,17.62 U6.24 | U3.16 U3.17 U3.18 | U6.24 44.86,17.88 45.47,17.27 45.97,17.27 47.24,18.54 48.02,18.54 C5.1 | U6.14 45.08,10.55 43.31,12.32 38.99,12.32 38.86,12.45 | 41.66,3.56 41.66,2.89 C7.1 42.54,1.91 | U6.24 44.83,18.78 44.83,19.68 v45.59,20.45 | R2.2 34.9,8.61 35.18,8.89 35.79,8.89 U6.44 | TP15.TP 41.78,3.43 41.66,3.56 | LED1.4 42.88,22.56 v43.43,23.11
  Top 0.61: C9.1 25.98,11.7 U1.5 27.12,13.74 27.32,13.55 28.22,13.55 C10.1 28.23,16.04 29.46,17.27 31.18,17.27 C18.1 C17.1 | U2.7 U2.8 12.7,5.08 12.51,4.89 11.94,4.89 | 25.65,14.99 23.62,14.99 22.86,14.22 22.86,12.95 20.32,10.41 19.05,10.41 17.78,9.14 17.78,8.38 18.54,7.62 17.27,6.35 U2.7 | 25.91,14.73 25.91,13.81 | 13.21,6.35 U2.7 | 50.15,18.61 C6.1 | U3.16 50.26,18.51 C6.1 | C15.1 11.4,4.89 11.94,4.89 | C5.1 50.15,18.71 C6.1 | C16.1 11.84,4.99 11.94,4.89 | U3.18 53.12,18.25 52.83,18.54 | C6.1 49.53,18.71 49.53,16.89 51.44,14.99 51.69,14.99 52.96,13.72 52.96,12.45 53.85,11.68 56.77,11.68 57.78,10.54 | JP1.1 58.93,5.33 | 58.93,5.33 57.78,6.6 57.78,10.54 | 57.78,10.54 58.17,10.54 JP2.2 | 58.93,5.33 58.93,4.59 58.24,3.9 R16.2
  Bottom 0.406: v45.59,20.45 45.59,21.97 44.58,22.99 43.56,22.99 v43.43,23.11
XM_EN  (via drill 0.33)
  Top 0.279: v29.97,14.22 29.97,13.84 30.61,13.21 R10.1 | U3.20 54.23,16.89 54.23,16 53.98,15.75 51.94,15.75 v51.31,16.51
  Bottom 0.279: v51.31,16.51 32.26,16.51 v29.97,14.22

### Text on the board
tPlace: VBAT | STAT1 | STAT2 | VCC | T08 - Tiny AV - Rev 1.0 | VBUS | Power